# EAGLE design dop (EAGLE 9.4.2)
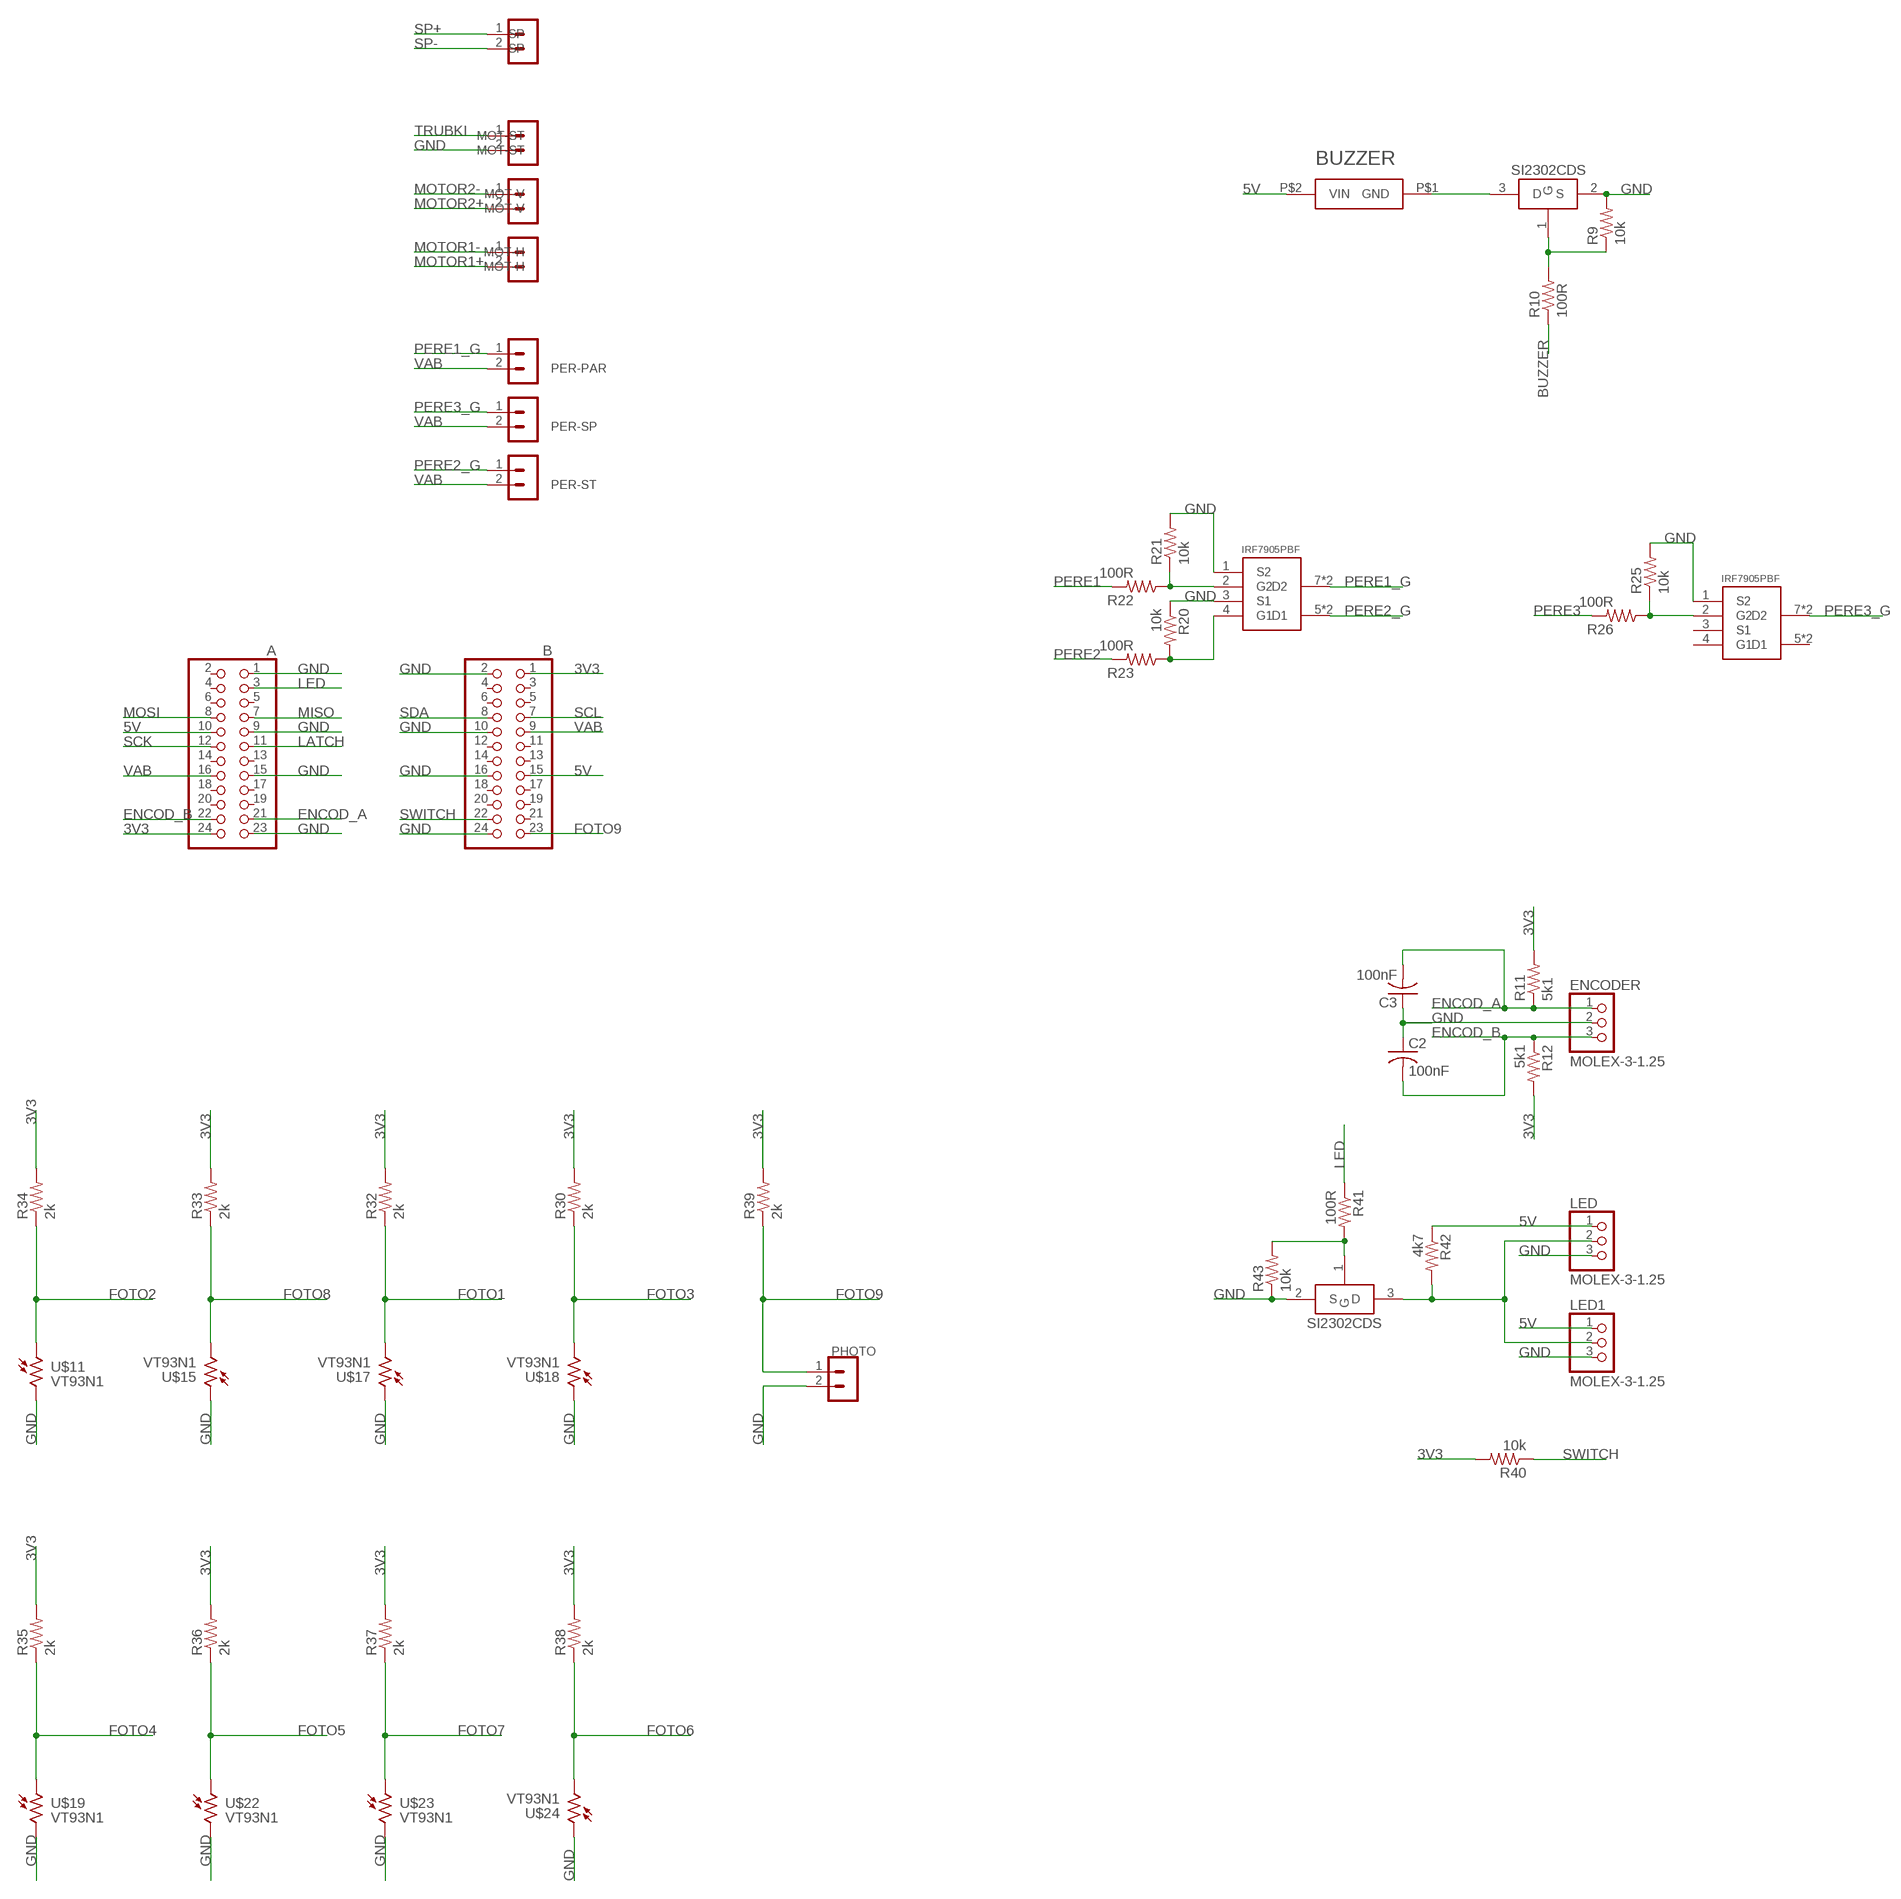
[diagram p0: schematic, sheet 1, part 1 of 2]
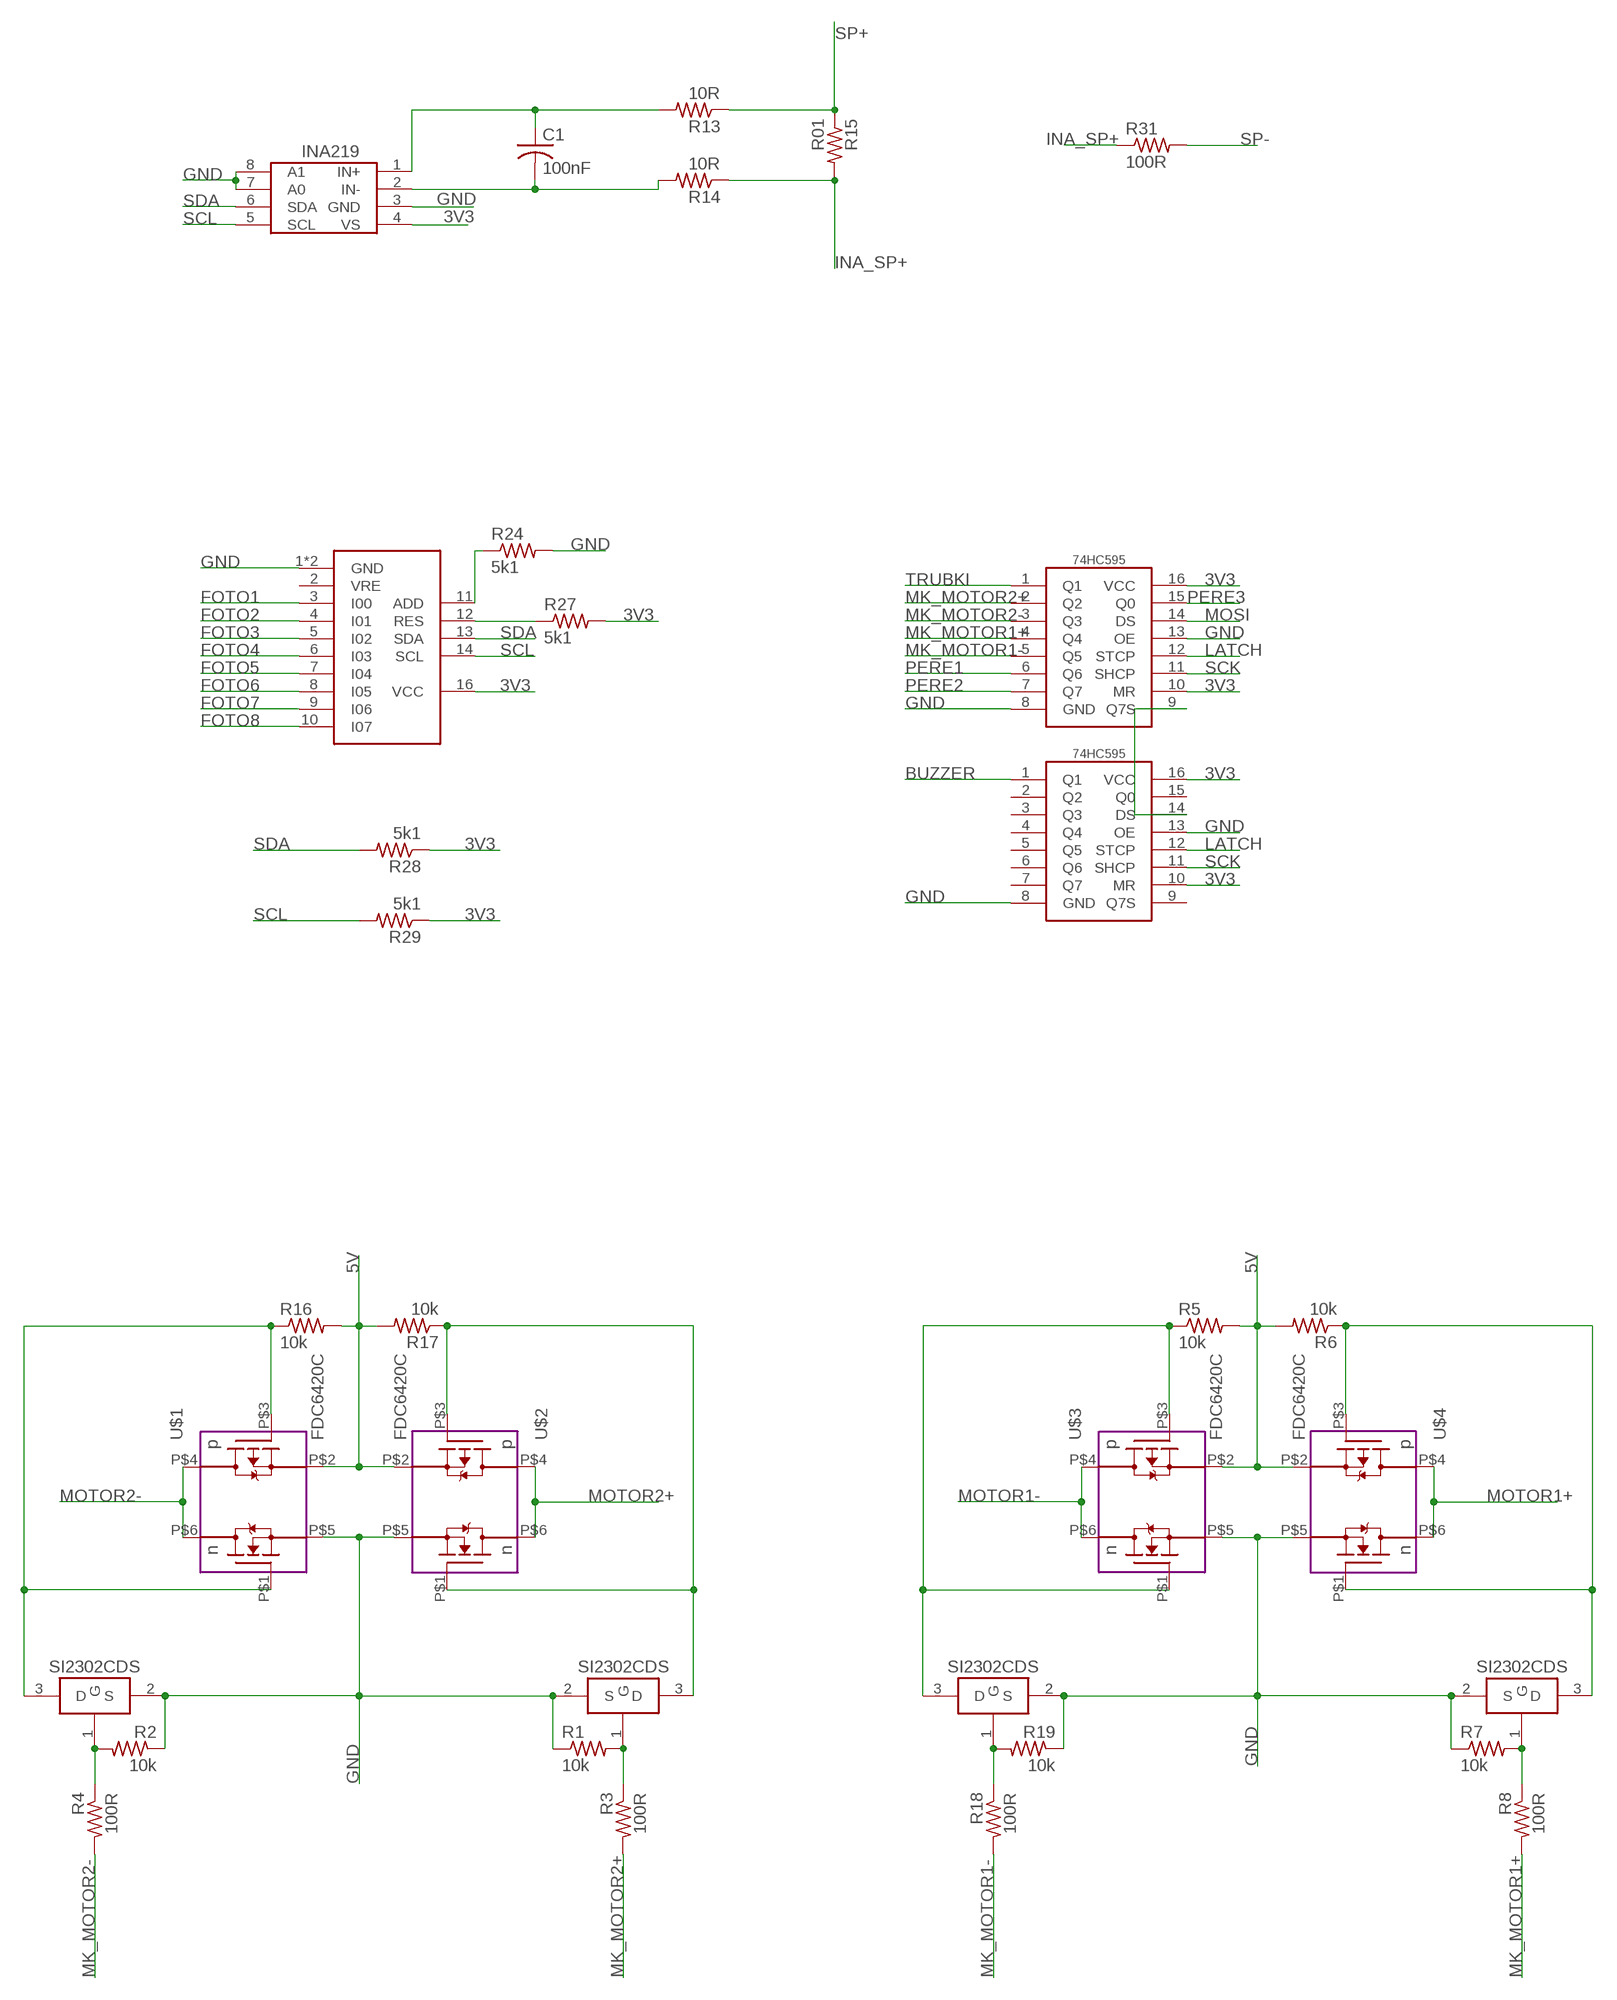
[diagram p1: schematic, sheet 1, part 2 of 2]

## Parts
74HC595  74HC595  [TSSOP16]
74HC595-  74HC595  [TSSOP16]
A  PINHD-2X12  [2X12]
AD5593  AD5593  [AD5593]
B  PINHD-2X12  [2X12]
BUZZER  BUZZERS8R6  [BUZZER-S8R12]
C1  100nF  C-USC0603  [C0603]
C2  100nF  C-USC0603  [C0603]
C3  100nF  C-USC0603  [C0603]
ENCODER  MOLEX-3-1.25  [53047-03]
INA  INA219AID  [SOT23-8]
IRF7905  IRF7905  [SO8]
IRF7905-  IRF7905  [SO8]
LED  MOLEX-3-1.25  [53047-03]
LED1  MOLEX-3-1.25  [53047-03]
MOT-H  MOLEX-2-1.25  [53047-02]
MOT-ST  MOLEX-2-1.25  [53047-02]
MOT-V  MOLEX-2-1.25  [53047-02]
PER-PAR  JST-2-2.5  [JST-2-2.5]
PER-SP  JST-2-2.5  [JST-2-2.5]
PER-ST  JST-2-2.5  [JST-2-2.5]
PHOTO  MOLEX-2-1.25  [53047-02]
R1  10k  R-US_R0603  [R0603]
R2  10k  R-US_R0603  [R0603]
R3  100R  R-US_R0603  [R0603]
R4  100R  R-US_R0603  [R0603]
R5  10k  R-US_R0603  [R0603]
R6  10k  R-US_R0603  [R0603]
R7  10k  R-US_R0603  [R0603]
R8  100R  R-US_R0603  [R0603]
R9  10k  R-US_R0603  [R0603]
R10  100R  R-US_R0603  [R0603]
R11  5k1  R-US_R0603  [R0603]
R12  5k1  R-US_R0603  [R0603]
R13  10R  R-US_R0603  [R0603]
R14  10R  R-US_R0603  [R0603]
R15  R01  R-US_R2512  [R2512]
R16  10k  R-US_R0603  [R0603]
R17  10k  R-US_R0603  [R0603]
R18  100R  R-US_R0603  [R0603]
R19  10k  R-US_R0603  [R0603]
R20  10k  R-US_R0603  [R0603]
R21  10k  R-US_R0603  [R0603]
R22  100R  R-US_R0603  [R0603]
R23  100R  R-US_R0603  [R0603]
R24  5k1  R-US_R0603  [R0603]
R25  10k  R-US_R0603  [R0603]
R26  100R  R-US_R0603  [R0603]
R27  5k1  R-US_R0603  [R0603]
R28  5k1  R-US_R0603  [R0603]
R29  5k1  R-US_R0603  [R0603]
R30  2k  R-US_R0603  [R0603]
R31  100R  R-US_0207/15  [0207/15]
R32  2k  R-US_R0603  [R0603]
R33  2k  R-US_R0603  [R0603]
R34  2k  R-US_R0603  [R0603]
R35  2k  R-US_R0603  [R0603]
R36  2k  R-US_R0603  [R0603]
R37  2k  R-US_R0603  [R0603]
R38  2k  R-US_R0603  [R0603]
R39  2k  R-US_R0603  [R0603]
R40  10k  R-US_R0603  [R0603]
R41  100R  R-US_R0603  [R0603]
R42  4k7  R-US_R0603  [R0603]
R43  10k  R-US_R0603  [R0603]
SI2302  SI2302CDS  [SOT23-3]
SI2302-  SI2302CDS  [SOT23-3]
SI2302-1  SI2302CDS  [SOT23-3]
SI2302-2  SI2302CDS  [SOT23-3]
SI2302-3  SI2302CDS  [SOT23-3]
SI2302-4  SI2302CDS  [SOT23-3]
SP  MOLEX-2-1.25  [53047-02]
U$1  FDC6420C  [TSOP-6]
U$2  FDC6420C  [TSOP-6]
U$3  FDC6420C  [TSOP-6]
U$4  FDC6420C  [TSOP-6]
U$11  VT93N1  [VT93N1]
U$15  VT93N1  [VT93N1]
U$17  VT93N1  [VT93N1]
U$18  VT93N1  [VT93N1]
U$19  VT93N1  [VT93N1]
U$22  VT93N1  [VT93N1]
U$23  VT93N1  [VT93N1]
U$24  VT93N1  [VT93N1]

## Nets
3V3: 74HC595-.10(MR) 74HC595-.16(VCC) 74HC595.10(MR) 74HC595.16(VCC) A.24 AD5593.16(VCC) B.1 INA.4(VS) R11.2 R12.2 R27.2 R28.1 R29.1 R30.2 R32.2 R33.2 R34.2 R35.2 R36.2 R37.2 R38.2 R39.2 R40.2
5V: A.10 B.15 BUZZER.P$2(VIN) LED1.1 LED.1 R5.2 R6.2 R16.2 R17.2 R42.1 U$1.P$2(PS) U$2.P$2(PS) U$3.P$2(PS) U$4.P$2(PS)
BUZZER: 74HC595-.1(Q1) R10.1
ENCOD_A: A.21 C3.2 ENCODER.1 R11.1
ENCOD_B: A.22 C2.2 ENCODER.3 R12.1
FOTO1: AD5593.3(I00) R32.1 U$17.P$2
FOTO2: AD5593.4(I01) R34.1 U$11.P$1
FOTO3: AD5593.5(I02) R30.1 U$18.P$2
FOTO4: AD5593.6(I03) R35.1 U$19.P$1
FOTO5: AD5593.7(I04) R36.1 U$22.P$1
FOTO6: AD5593.8(I05) R38.1 U$24.P$2
FOTO7: AD5593.9(I06) R37.1 U$23.P$1
FOTO8: AD5593.10(I07) R33.1 U$15.P$2
FOTO9: B.23 PHOTO.1 R39.1
GND: 74HC595-.8(GND) 74HC595-.13(OE) 74HC595.8(GND) 74HC595.13(OE) A.1 A.9 A.15 A.23 AD5593.1(GND) AD5593.15(GND) B.2 B.10 B.16 B.24 C2.1 C3.1 ENCODER.2 INA.3(GND) INA.7(A0) INA.8(A1) IRF7905-.1(S2) IRF7905.1(S2) IRF7905.3(S1) LED1.3 LED.3 MOT-ST.2 PHOTO.2 R1.1 R2.1 R7.1 R9.2 R19.1 R20.1 R21.2 R24.2 R25.2 R43.1 SI2302-1.2(S) SI2302-2.2(S) SI2302-3.2(S) SI2302-4.2(S) SI2302-.2(S) SI2302.2(S) U$1.P$5(NS) U$2.P$5(NS) U$3.P$5(NS) U$4.P$5(NS) U$11.P$2 U$15.P$1 U$17.P$1 U$18.P$1 U$19.P$2 U$22.P$2 U$23.P$2 U$24.P$1
INA_SP+: R14.1 R15.2 R31.1
LATCH: 74HC595-.12(STCP) 74HC595.12(STCP) A.11
LED: A.3 R41.1
MISO: A.7
MK_MOTOR1+: 74HC595.4(Q4) R8.2
MK_MOTOR1-: 74HC595.5(Q5) R18.2
MK_MOTOR2+: 74HC595.2(Q2) R3.2
MK_MOTOR2-: 74HC595.3(Q3) R4.2
MOSI: 74HC595.14(DS) A.8
MOTOR1+: MOT-H.2 U$4.P$4(PD) U$4.P$6(ND)
MOTOR1-: MOT-H.1 U$3.P$4(PD) U$3.P$6(ND)
MOTOR2+: MOT-V.2 U$2.P$4(PD) U$2.P$6(ND)
MOTOR2-: MOT-V.1 U$1.P$4(PD) U$1.P$6(ND)
N$1: R1.2 R3.1 SI2302-3.1(G)
N$3: R2.2 R4.1 SI2302-1.1(G)
N$5: R5.1 SI2302-2.3(D) U$3.P$1(NG) U$3.P$3(PG)
N$6: R7.2 R8.1 SI2302-4.1(G)
N$7: R18.1 R19.2 SI2302-2.1(G)
N$8: R6.1 SI2302-4.3(D) U$4.P$1(NG) U$4.P$3(PG)
N$10: IRF7905.4(G1) R20.2 R23.1
N$12: IRF7905.2(G2) R21.1 R22.1
N$13: BUZZER.P$1(GND) SI2302-.3(D)
N$14: R9.1 R10.2 SI2302-.1(G)
N$15: C1.1 INA.1(IN+) R13.2
N$16: C1.2 INA.2(IN-) R14.2
N$17: R41.2 R43.2 SI2302.1(G)
N$18: AD5593.12(RES) R27.1
N$19: R17.1 SI2302-3.3(D) U$2.P$1(NG) U$2.P$3(PG)
N$20: AD5593.11(ADD) R24.1
N$21: IRF7905-.2(G2) R25.1 R26.1
N$22: 74HC595-.14(DS) 74HC595.9(Q7S)
N$23: LED1.2 LED.2 R42.2 SI2302.3(D)
N$24: R16.1 SI2302-1.3(D) U$1.P$1(NG) U$1.P$3(PG)
PERE1: 74HC595.6(Q6) R22.2
PERE1_G: IRF7905.7(D2) IRF7905.8(D2) PER-PAR.1
PERE2: 74HC595.7(Q7) R23.2
PERE2_G: IRF7905.5(D1) IRF7905.6(D1) PER-ST.1
PERE3: 74HC595.15(Q0) R26.2
PERE3_G: IRF7905-.7(D2) IRF7905-.8(D2) PER-SP.1
SCK: 74HC595-.11(SHCP) 74HC595.11(SHCP) A.12
SCL: AD5593.14(SCL) B.7 INA.5(SCL) R29.2
SDA: AD5593.13(SDA) B.8 INA.6(SDA) R28.2
SP+: R13.1 R15.1 SP.1
SP-: R31.2 SP.2
SWITCH: B.22 R40.1
TRUBKI: 74HC595.1(Q1) MOT-ST.1
VAB: A.16 B.9 PER-PAR.2 PER-SP.2 PER-ST.2
Unconnected: 74HC595-.2(Q2) 74HC595-.3(Q3) 74HC595-.4(Q4) 74HC595-.5(Q5) 74HC595-.6(Q6) 74HC595-.7(Q7) 74HC595-.9(Q7S) 74HC595-.15(Q0) A.2 A.4 A.5 A.6 A.13 A.14 A.17 A.18 A.19 A.20 AD5593.2(VRE) B.3 B.4 B.5 B.6 B.11 B.12 B.13 B.14 B.17 B.18 B.19 B.20 B.21 IRF7905-.3(S1) IRF7905-.4(G1) IRF7905-.5(D1) IRF7905-.6(D1)

## Library data of the parts
74HC595 74HC595- = CanCubeSat:74HC595
A B = pinhead:PINHD-2X12: PIN HEADER
AD5593 = CanCubeSat:AD5593
BUZZER = CanCubeSat:BUZZER
C1-C3 = rcl:C-US: CAPACITOR, American symbol; SPICEPREFIX: C
ENCODER LED LED1 = CanCubeSat:MOLEX-3-1.25
INA = CanCubeSat:INA219AID
IRF7905 IRF7905- = CanCubeSat:IRF7905
MOT-H MOT-ST MOT-V PHOTO SP = CanCubeSat:MOLEX-2-1.25
PER-PAR PER-SP PER-ST = CanCubeSat:JST-2-2.5: JST PH series header 2.00mm pitch disconnectable crimp style connectors, vertical (side entry type), 2 pins
R1-R30 R32-R43 = rcl:R-US_: RESISTOR, American symbol; SPICEPREFIX: R
R31 = CanCubeSat:R-US_: RESISTOR, American symbol; SPICEPREFIX: R
SI2302 SI2302- SI2302-1-SI2302-4 = CanCubeSat:SI2302CDS
U$1-U$4 = KNPN-2023:FDC6420C
U$11 U$15 U$17-U$19 U$22-U$24 = KNPN-2023:VT93N1

## Board
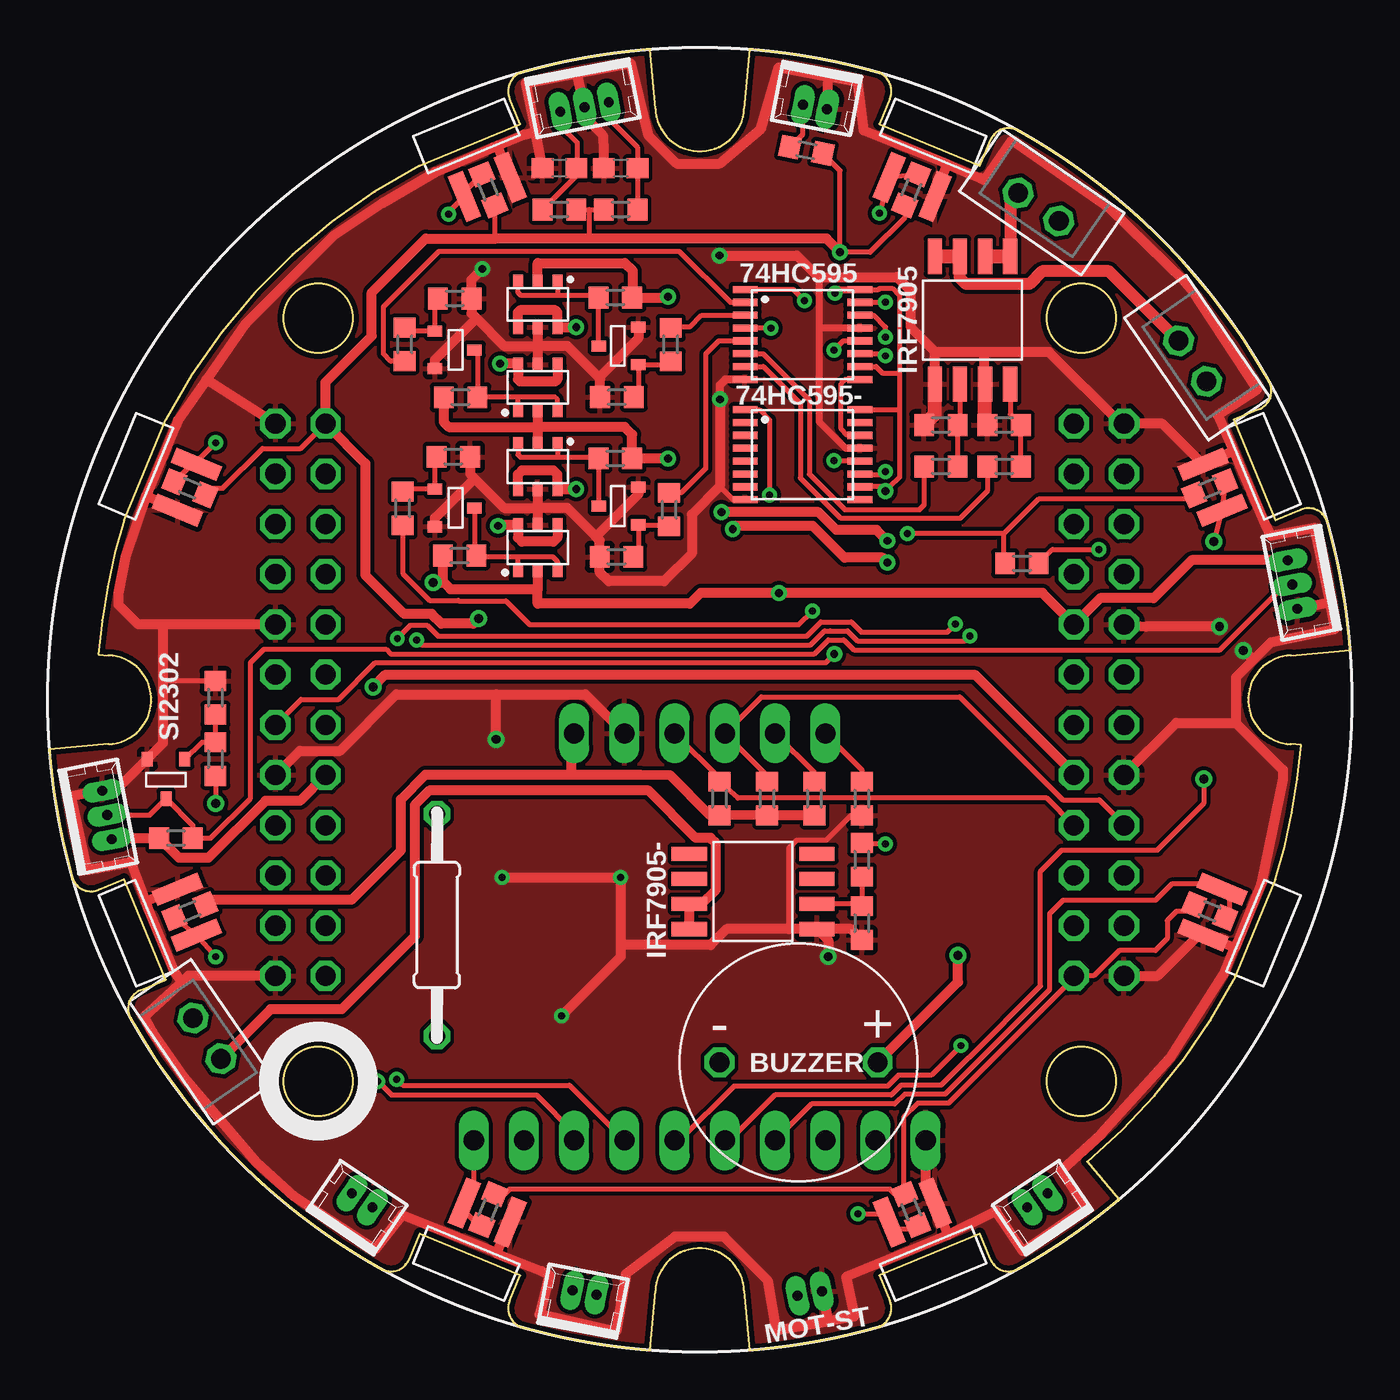
[diagram p2: board, top side]
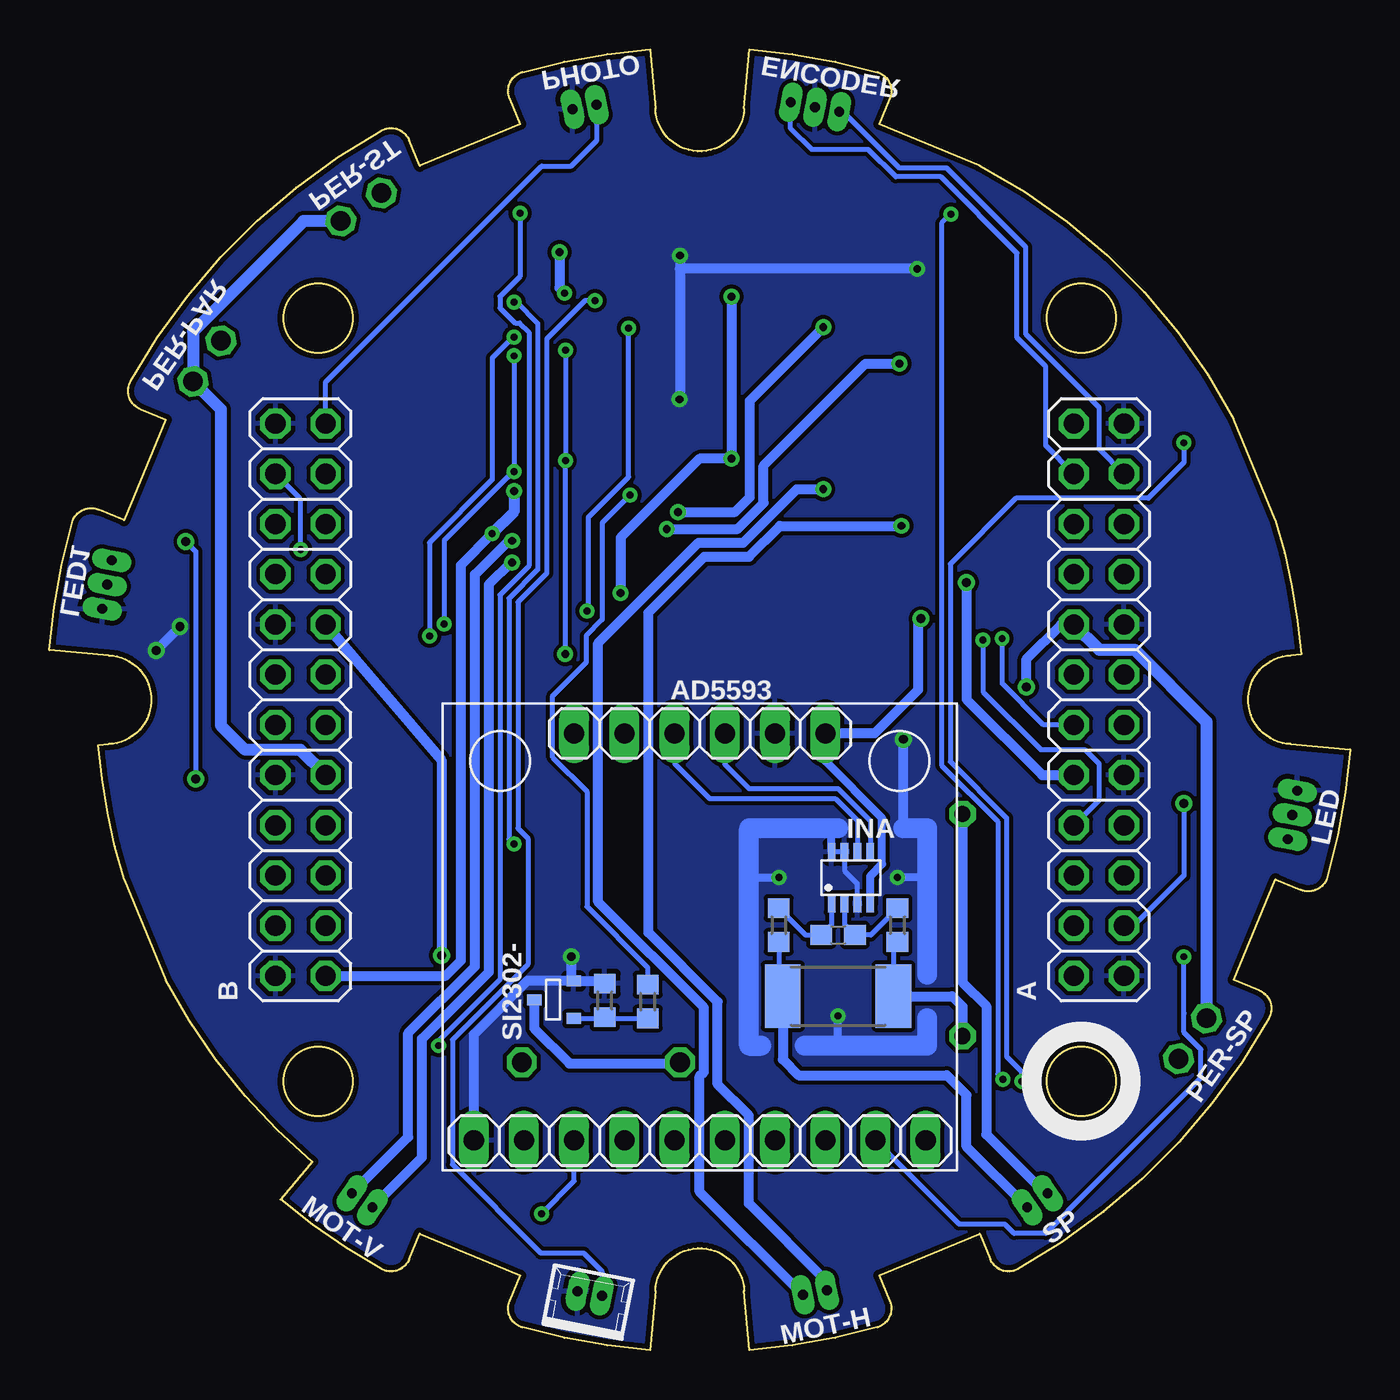
[diagram p3: board, bottom side, seen from below]

Size 65.81 x 65.81 mm. Coordinates in mm from the lower left corner, seen from the top.
Outline: 3.78,41.99 5.88,47.07 arc-35 18.74,59.92 23.82,62.03 23.28,63.32 arc-97 23.94,64.66 arc-11 30.39,65.81 30.66,62.82 arc176 35.15,62.82 35.41,65.81 arc-11 41.87,64.66 arc-97 42.53,63.32 41.99,62.03 47.07,59.92 47.61,61.21 arc-97 49.02,61.7 arc-32 61.7,49.02 arc-97 61.21,47.61 59.92,47.07 62.03,41.99 63.32,42.53 arc-97 64.66,41.87 arc-11 65.81,35.41 62.82,35.15 arc176 62.82,30.66 63.33,30.61 arc-13 62.03,23.82 59.92,18.74 arc-22 52.52,9.53 54.12,7.63 arc-11 49.02,4.11 arc-97 47.61,4.6 47.07,5.88 41.99,3.78 42.53,2.49 arc-97 41.87,1.15 arc-11 35.41,0 35.15,2.99 arc176 30.66,2.99 30.39,0 arc-11 23.94,1.15 arc-97 23.28,2.49 23.82,3.78 18.74,5.88 18.2,4.6 arc-97 16.79,4.11 arc-32 4.11,16.79 arc-97 4.6,18.2 5.88,18.74 3.78,23.82 2.49,23.28 arc-97 1.15,23.94 arc-11 0,30.39 2.99,30.66 arc176 2.99,35.15 2.48,35.2 arc-13 3.78,41.99
Outline: circle at 13.6,13.6 radius 1.75
Outline: circle at 52.2,13.6 radius 1.75
Outline: circle at 52.2,52.2 radius 1.75
Outline: circle at 13.6,52.2 radius 1.75
Copper layers (1*16): Top 0.035mm / dielectric 1.5mm / Bottom 0.035mm
Design rules "default *": minimum track width 0.2mm, minimum drill 0.35mm, track to track 0.2mm, track to pad 0.2mm, pad to pad 0.2mm, via to via 0.2mm, smd to smd 0.2mm, copper to edge 0.25mm, drill to drill 0.1mm, minimum pad ring 10mil, minimum via ring 8mil, stop-mask expansion 3mil, vias tented up to drill 0mil, thermal gap 10mil

### Footprints (pad centres in the part's own frame; a part is rotated, then mirrored left to right if it is on the bottom)
TSSOP16 = smd 1.26 x 0.36: 1 -2.9,2.275; 2 -2.9,1.625; 3 -2.9,0.975; 4 -2.9,0.325; 5 -2.9,-0.325; 6 -2.9,-0.975; 7 -2.9,-1.625; 8 -2.9,-2.275; 9 2.9,-2.275; 10 2.9,-1.625; 11 2.9,-0.975; 12 2.9,-0.325; 13 2.9,0.325; 14 2.9,0.975; 15 2.9,1.625; 16 2.9,2.275
2X12 = drill 1.016 octagon: 1 -13.97,-1.27; 2 -13.97,1.27; 3 -11.43,-1.27; 4 -11.43,1.27; 5 -8.89,-1.27; 6 -8.89,1.27; 7 -6.35,-1.27; 8 -6.35,1.27; 9 -3.81,-1.27; 10 -3.81,1.27; 11 -1.27,-1.27; 12 -1.27,1.27; 13 1.27,-1.27; 14 1.27,1.27; 15 3.81,-1.27; 16 3.81,1.27; 17 6.35,-1.27; 18 6.35,1.27; 19 8.89,-1.27; 20 8.89,1.27; 21 11.43,-1.27; 22 11.43,1.27; 23 13.97,-1.27; 24 13.97,1.27
AD5593 = drill 1.016 long: 1 -11.43,-10.3; 2 -8.89,-10.3; 3 -6.35,-10.3; 4 -3.81,-10.3; 5 -1.27,-10.3; 6 1.27,-10.3; 7 3.81,-10.3; 8 6.35,-10.3; 9 8.89,-10.3; 10 11.43,-10.3; 11 -6.35,10.3; 12 -3.81,10.3; 13 -1.27,10.3; 14 1.27,10.3; 15 3.81,10.3; 16 6.35,10.3
BUZZER-S8R12 = drill 1 octagon: P$1 -4,0; P$2 4,0
C0603 = smd 1.1 x 1: 1 -0.85,0; 2 0.85,0
53047-03 = drill 0.5 pad 0.698 long: 1 1.25,0.45; 2 0,0.45; 3 -1.25,0.45
SOT23-8 = smd 0.9 x 0.4: 1 -1.3,0.975; 2 -1.3,0.325; 3 -1.3,-0.325; 4 -1.3,-0.975; 5 1.3,-0.975; 6 1.3,-0.325; 7 1.3,0.325; 8 1.3,0.975
SO8 = smd 0.72 x 1.78: 1 -1.905,-3.23; 2 -0.635,-3.23; 3 0.635,-3.23; 4 1.905,-3.23; 5 1.905,3.23; 6 0.635,3.23; 7 -0.635,3.23; 8 -1.905,3.23
53047-02 = drill 0.5 pad 0.698 long: 1 0.625,0.45; 2 -0.625,0.45
JST-2-2.5 = drill 1 pad 1.5 octagon: 1 1.25,0; 2 -1.25,0
R0603 = smd 1 x 1.1: 1 -0.85,0; 2 0.85,0
R2512 = smd 1.8 x 3.2: 1 -2.8,0; 2 2.8,0
0207/15 = drill 0.813 octagon: 1 -5.62,0; 2 5.62,0
SOT23-3 = smd 0.56 x 0.73: 1 -0.95,-1; 2 0.95,-1; 3 0,1
TSOP-6 = smd 0.5 x 0.7: P$1 -1,-1.15; P$2 0,-1.15; P$3 1,-1.15; P$4 1,1.15; P$5 0,1.15; P$6 -1,1.15
VT93N1 = smd 0.8 x 2.5: P$1 -1.25,-1.8; P$2 1.25,-1.8

### Placement (x,y rotation side)
74HC595  38.1,51.38 0 top
74HC595-  38.1,45.3 0 top
A  12.7,32.9 90 bottom
AD5593  32.9,20.9 0 bottom
B  53.1,32.9 90 bottom
BUZZER  37.9,14.55 0 top
C1  25.9,21 0 bottom
C2  28.9,59.8 0 top
C3  25.8,59.8 0 top
ENCODER  26.99,63.33 191 top
INA  25.25,23.9 90 bottom
IRF7905  46.7,52.1 0 top
IRF7905-  35.6,23.2 90 top
LED  2.47,26.99 281 top
LED1  63.33,38.82 101 top
MOT-H  26.99,2.47 349 top
MOT-ST  38.55,2.42 349 bottom
MOT-V  50.24,7.2 34 top
PER-PAR  57.83,50.04 124.5 top
PER-SP  7.97,15.77 304.5 top
PER-ST  50.04,57.83 145.5 top
PHOTO  38.82,63.33 169 top
R1  20.5,53.2 180 top
R2  28.71,48.21 0 top
R3  17.97,50.88 270 top
R4  31.43,50.87 90 top
R5  28.63,45.11 0 top
R6  20.75,40.19 180 top
R7  20.43,45.19 180 top
R8  17.87,42.58 270 top
R9  37.71,17.69 90 bottom
R10  35.53,17.63 270 bottom
R11  25.8,57.7 0 top
R12  28.9,57.7 180 top
R13  28.9,21.5 90 bottom
R14  22.9,21.5 90 bottom
R15  25.9,17.9 0 bottom
R16  28.63,53.25 0 top
R17  20.8,48.2 180 top
R18  31.35,42.52 90 top
R19  28.69,40.13 0 top
R20  48.3,46.8 0 top
R21  45.1,46.8 180 top
R22  45.1,44.7 180 top
R23  48.3,44.7 180 top
R24  41.1,27.9 270 top
R25  41.1,21.6 270 top
R26  41.1,24.8 90 top
R27  38.7,27.9 270 top
R28  36.3,27.9 90 top
R29  33.9,27.9 90 top
R30  58.7,43.6 202.5 top
R31  19.6,21.5 90 top
R32  43.6,7.1 112.5 top
R33  22.2,7.1 67.5 top
R34  58.7,22.2 157.5 top
R35  43.6,58.7 247.5 top
R36  22.2,58.7 292.5 top
R37  7.1,22.2 22.5 top
R38  7.1,43.6 337.5 top
R39  38.3,60.7 349 top
R40  49.2,39.8 180 top
R41  8.4,29.9 90 top
R42  6.4,25.9 0 top
R43  8.4,33 270 top
SI2302  5.9,28.9 180 top
SI2302-  40.28,17.72 90 bottom
SI2302-1  28.8,50.8 90 top
SI2302-2  28.8,42.7 90 top
SI2302-3  20.5,50.6 270 top
SI2302-4  20.5,42.6 270 top
SP  15.57,7.2 326 top
U$1  24.7,52.9 180 top
U$2  24.7,48.7 0 top
U$3  24.7,44.7 180 top
U$4  24.7,40.6 0 top
U$11  60.51,21.47 247.5 top
U$15  21.47,5.29 157.5 top
U$17  44.34,5.29 202.5 top
U$18  60.51,44.34 292.5 top
U$19  44.34,60.51 337.5 top
U$22  21.47,60.51 22.5 top
U$23  5.29,21.47 112.5 top
U$24  5.29,44.34 67.5 top

### Tracks (layer width: path | path; a pad name or v marks a point on that pad's centre or on a via)
3V3  (via drill 0.35, 0.4, 0.45)
  Top 0.25: R34.2 57.59,22.2 57.03,22.2 56.56,21.74 56.56,20.82 55.96,20.22 54.12,20.22 52.84,18.93 B.1 51.93,18.93 47.9,14.9 45.5,12.5 43.93,12.5 43.25,11.82 43.25,7.92 R32.2 42.78,7.89 42.53,8.14 23.27,8.14 23.03,7.89 R33.2 | 43.02,47.58 43.02,44.16 42.54,43.68 42.4,43.68 | 74HC595-.16 43.02,47.58 | 42.4,43.68 74HC595-.10 | 43.02,49.44 43.02,53.35 42.64,53.72 42.01,53.72 41.95,53.66 74HC595.16 | 43.02,49.44 43.02,47.58 | 74HC595.10 41.82,49.76 42.14,49.44 43.02,49.44 | 42.4,43.68 42.4,43.57 v42.3,43.47 | R35.2 43.28,57.3 41.52,55.55 v40,55.55 40,59.68 R39.2 | R38.2 8.22,43.61 8.77,43.61 10.78,45.62 12.72,45.62 A.24 | 48.3,41.3 50.05,43.05 57.69,43.05 R30.2 | 48.3,41.3 v43.4,41.3 | R40.2 48.3,39.85 48.3,41.3 | R39.2 | R36.2 22.53,56.3 22.59,56.24 | R11.2 27.3,57.7 | 27.3,57.7 R12.2 | 27.3,57.7 27.3,56.24
  Top 0.35: v39.73,53.47 39.93,53.66 74HC595.16
  Top 0.5: R27.2 R28.1 33.99,27.06 R29.1 33.43,27.06 31.39,29.1 29.9,29.11 26.4,29.11 | v40,55.55 39.32,56.24 27.3,56.24 22.59,56.24 19.04,56.24 16.3,53.5 16.3,51.3 13.97,48.97 A.24 15.98,44.86 15.98,39.22 17.96,37.25 19.34,37.25 19.84,36.76 21.46,36.76 v21.7,37 | R37.2 8.15,22.79 15.29,22.79 17.79,25.29 17.79,27.87 19.03,29.11 26.4,29.11 | AD5593.16 26.4,31.2 26.4,29.11
  Bottom 0.4: INA.4 24.28,23.99 23.68,24.59 23.68,26.92 26.55,29.8 AD5593.16
  Bottom 0.5: v43.4,41.3 45,39.71 45,19.69 45.76,18.93 B.1 | v40,55.55 40,53.74 v39.73,53.47 | v21.7,37 21.85,36.85 21.85,33.4 24.05,31.2 AD5593.16
  Bottom 0.55: v42.3,43.47 42.3,42.4 v43.4,41.3
5V  (via drill 0.4, 0.45)
  Top 0.5: LED.1 3.21,25.9 R42.1 6.55,24.9 8.04,24.9 10.93,27.79 12.67,27.79 A.10 | LED1.1 57.79,39.96 55.88,38.04 53.16,38.04 B.15 50.24,38.3 v36.9,38.3 32.95,38.3 32.4,37.76 24.7,37.76 24.7,38.5 | BUZZER.P$2 45.97,18.62 v45.97,19.97 | U$2.P$2 24.7,46.7 | 24.7,46.7 U$3.P$2 | U$4.P$2 24.7,38.5 | U$1.P$2 24.7,55 29.1,55 29.5,54.6 29.5,53.27 R16.2 31.25,53.25 v31.3,53.3 | R17.2 19.95,46.95 20.2,46.7 24.7,46.7 | 24.7,46.7 29.1,46.7 29.48,46.32 R5.2 v31.29,45.11 v31.3,45.1 | R6.2 19.9,38.89 19.97,38.83 | 24.7,38.5 20.29,38.5 19.97,38.83 | v19.4,38.83 19.97,38.83
  Bottom 0.5: B.15 45.97,29.85 v45.97,19.97 | v19.4,38.83 19.4,32.92 15.57,29.09 A.10 | v31.3,53.3 v31.3,45.1 32.9,45.1 36.9,41.1 v36.9,38.3
BUZZER  (via drill 0.35)
  Top 0.25: v36.44,43.25 36.44,47.07 35.92,47.58 74HC595-.1
  Bottom 0.25: v36.44,43.25 37.84,41.85 37.84,36.95 38.64,36.14 38.64,34.8 40.34,33.1 40.34,29.99 38.62,28.27 38.62,22.44 35.53,19.36 R10.1
ENCOD_A
  Top 0.25: R11.1 26.65,59.4 C3.2 26.7,59.85 26.7,61.1 25.85,61.96 ENCODER.1
  Bottom 0.25: ENCODER.1 25.65,62.65 22.8,59.81 20.41,59.81 16.4,55.8 16.4,51.4 12.7,47.7 12.7,45.6 A.21
ENCOD_B
  Top 0.25: R12.1 C2.2 29.75,60.85 28.3,62.31 ENCODER.3
  Bottom 0.25: A.22 15.4,45.76 15.4,49.77 16.85,51.22 16.85,55.51 20.7,59.36 22.99,59.36 24.37,60.74 27.24,60.74 28.3,61.8 ENCODER.3
FOTO1  (via drill 0.35)
  Top 0.25: v40.9,6.9 42.07,6.9 U$17.P$2 42.86,6.12 43.73,6.12 R32.1
  Bottom 0.25: v40.9,6.9 39.25,8.55 AD5593.3
FOTO2
  Top 0.25: R34.1 59.69,22.08 59.69,23.07 59.45,23.31 U$11.P$1 59.32,23.31 59.05,23.58 56.78,23.58 55.96,22.76 51.28,22.76 50.6,22.07 50.6,18.23 45.31,12.95 43.28,12.95 42.78,12.45 38.56,12.45 AD5593.4
FOTO3  (via drill 0.45)
  Top 0.25: AD5593.5 34.42,10.6 36.71,12.9 42.59,12.9 43.09,13.4 45.12,13.4 46.51,14.79 46.52,14.79 50.15,18.42 50.15,24.22 51.22,25.3 56.06,25.3 58.4,27.65 v58.4,28.9 | R30.1 U$18.P$2 v58.9,40.9
  Bottom 0.25: v58.9,40.9 58.4,40.4 v58.4,28.9
FOTO4  (via drill 0.35)
  Top 0.25: AD5593.6 31.88,10.6 34.62,13.35 42.4,13.35 42.96,13.9 44.62,13.9 v46.12,15.4 | R35.1 U$19.P$1 v42,57.52
  Bottom 0.25: v42,57.52 42,54.31 43.01,53.31 43.01,52.73 42.25,51.96 42.01,51.96 41.55,51.5 41.55,39.67 43.01,38.21 43.01,18.75 46.12,15.63 v46.12,15.4
FOTO5  (via drill 0.35)
  Top 0.25: v17.58,13.7 17.88,13.4 26.31,13.4 29.09,10.62 AD5593.7 | R36.1 21,58.61 U$22.P$1 20.2,57.58 v20.2,57.48
  Bottom 0.25: v17.58,13.7 17.83,13.96 17.83,26.74 20.68,29.59 20.68,57.01 v20.2,57.48
FOTO6  (via drill 0.35)
  Top 0.25: AD5593.8 26.55,11 24.65,12.9 17.31,12.9 v16.62,13.59 | v8.4,45.9 7.44,44.94 | 7.44,44.94 U$24.P$2 | R38.1 7.32,44.94 7.44,44.94
  Bottom 0.25: v8.4,45.9 8.4,44.9 10.2,43.1 16.9,43.1 20.23,39.78 20.23,29.78 17.38,26.93 17.38,14.85 16.62,14.09 v16.62,13.59
FOTO7  (via drill 0.35)
  Top 0.25: R37.1 U$23.P$1 v8.4,19.9
  Bottom 0.25: AD5593.9 19.78,6.37 17.47,6.37 17,5.9 15.4,5.9 14.34,6.97 14.27,7.01 14.27,7.04 7.54,13.77 7.54,15.21 8.4,16.08 8.4,17.02 8.41,17.04 8.4,17.05 v8.4,19.9
FOTO8
  Top 0.25: R33.1 21.73,6.32 20.89,7.16 21,7.27 U$15.P$2 21,8 21.47,8.47 AD5593.10
FOTO9
  Top 0.25: R39.1 38.12,61.52 PHOTO.1
  Bottom 0.25: B.23 51.83,48.97 40.9,59.9 39.4,59.9 38.1,61.2 38.1,63 PHOTO.1
GND  (via drill 0.35, 0.4, 0.45)
  Top 0.25: 33.93,43.7 33.93,43.69 34.58,43.03 74HC595-.8 | R24.2 40.55,27.05 39.29,25.79 37.81,25.79 37.4,25.39 37.4,21.3 | R43.1 5.8,33.85 5.75,33.9
  Top 0.35: 74HC595-.13 40.28,45.63 38.95,46.96 38.95,51.71 | 74HC595.13 38.95,51.71 | 38.95,51.71 38.95,54.25 38.9,54.3
  Top 0.4: 74HC595.8 34.2,49.11 33.93,48.83 v33.93,48.1
  Top 0.5: 45.49,5.82 40.3,3.7 40.72,1.69 39.4,1.46 | 22.63,4.96 17.84,6.85 16.48,5.11 12.4,7.77 10.49,9.49 6.79,13.83 5.2,16.1 4.8,16.85 6.57,18.48 6.7,18.61 | MOT-ST.2 39.39,1.48 39.4,1.46 | 39.4,1.46 39.4,1.45 36.77,1 36.33,3.54 34.14,5.73 31.64,5.73 29.16,3.85 28.66,0.94 24.79,1.8 25.3,3.8 24.92,3.99 22.61,4.91 22.63,4.96 | 4.88,43.21 6.36,46.69 6.51,47.06 7.95,49.11 | 7.95,49.11 9.9,51.9 14.4,56.4 16.83,58.02 19.5,59.6 22.43,60.84 22.69,60.95 | 26.69,64.59 24.1,64.1 24.6,61.8 24.6,61.65 | 26.69,64.59 29.4,65.1 30.29,61.47 31.73,60.03 33.91,60.03 36,61.8 36.9,64.9 39.41,64.43 | 45.44,59.99 46.6,59.5 47.1,59.3 47.3,59.2 48.7,61.2 53.6,57.8 57.41,54.09 57.77,53.68 61.1,48.6 59.1,47.3 59.89,45.5 | 59.89,45.5 61.5,41.8 61.8,41.2 64,41.6 64.77,37.84 | 64.77,37.84 65.05,36.49 61.81,35.81 60.9,34.91 | 60.9,34.91 60.03,34.04 60.03,31.73 | 60.03,31.73 62.4,29.36 62.4,28.9 61.3,23.6 60,20.37 59.96,20.38 | 59.96,20.38 59.4,19 56.68,14.76 53.2,10.9 51.2,9.1 52.44,7.2 49.24,5 47.89,7.03 45.49,5.82 | 59.96,20.38 U$11.P$2 58.26,21.12 56.07,18.93 B.2 | LED1.3 64.77,37.84 | 26.69,64.59 ENCODER.2 27.08,62.39 28.01,61.46 C2.1 | U$24.P$1 4.88,43.21 | 59.89,45.5 U$18.P$1 56.31,46.87 B.24 54.37,46.9 54.17,46.9 50.57,50.5 47.3,50.5 | C3.1 24.6,61.65 | U$19.P$2 44.81,58.46 45.44,59.99 | R25.2 40.56,21.3 IRF7905-.1 | v33.9,55.38 37.82,55.38 38.9,54.3 42.88,54.3 43.59,53.58 43.59,51.73 44.8,50.52 44.8,50.5 | A.1 7.03,18.93 6.7,18.61 | 28.9,20.4 v28.9,23.9 v22.9,23.9 | 28.9,20.4 28.9,19.9 v25.9,16.9 | IRF7905-.1 37.4,21.3 34.26,21.3 33.45,20.49 28.99,20.49 28.9,20.4 | IRF7905-.1 39.4,20.73 v39.4,19.9
  Top 0.5: B.10 57.01,31.73 60.03,31.73 | v59.2,36.6 55.48,36.6 B.16 | A.9 12.66,30.32 14.7,30.32 17.55,33.18 22.6,33.18 | AD5593.15 27.12,33.18 22.6,33.18 | v22.6,30.9 22.6,33.18 | AD5593.1 44.33,8.58 U$17.P$1 45.47,5.84 45.49,5.82 | U$15.P$1 22.63,4.96 | 4.88,43.21 3.87,40.22 3.5,38.28 3.5,37.7 4.49,36.71 5.8,36.71 | 39.41,64.43 40.91,64.14 41.2,61.7 45.44,59.99 | PHOTO.2 39.41,64.43 | 4.86,22.69 4.1,24.7 1.9,24.3 1.08,28 LED.3 3.35,28.3 SI2302.2 5.75,30.7 5.75,33.9 5.75,36.66 5.8,36.71 | 4.86,22.69 5.03,22.23 6.31,19.15 6.7,18.61 | U$23.P$2 4.86,22.69 | v60.4,35.4 60.9,34.91 | 22.69,60.95 24,61.5 24.6,61.65 | A.23 7.95,49.11 | U$22.P$2 22.69,60.95 | U$1.P$5 24.7,50.8 | 24.7,50.8 U$2.P$5 | U$3.P$5 24.7,42.6 | 24.7,42.6 U$4.P$5 | A.15 5.8,36.71 | IRF7905.1 44.8,50.5 | 47.3,50.5 44.8,50.5 | IRF7905.3 47.3,48.91 47.3,50.5 | 21.6,52.2 21.35,52.45 R1.1 21.35,54.15 v21.9,54.7 | 21.6,52.2 23,50.8 24.7,50.8 | R2.1 27.86,49.14 27.8,49.2 | 24.7,50.8 26.2,50.8 27.8,49.2 | 27.65,41.15 27.84,40.96 R19.1 27.84,39.36 28.3,38.9 31.1,38.9 32.5,40.3 32.5,42.28 33.93,43.7 v33.93,48.1 | 27.65,41.15 26.2,42.6 24.7,42.6 | R7.1 21.28,44.32 21.5,44.1 | 21.5,44.1 23,42.6 24.7,42.6 | SI2302-3.2 19.5,50.1 21.6,52.2 | SI2302-4.2 19.5,42.1 21.5,44.1 | SI2302-2.2 29.8,43.3 27.65,41.15 | SI2302-1.2 29.8,51.2 27.8,49.2
  Top 0.7: R21.2 44.8,47.35 IRF7905.1 | R20.1 47.34,46.92 IRF7905.3
  Bottom 0.25: 39.31,18.7 SI2302-.2 | INA.3 24.93,23.59 25.58,24.24 INA.7 INA.8
  Bottom 0.4: INA.8 26.23,26.4 25.9,26.4 | 21.4,23.9 v22.9,23.9 | 30.4,23.9 v28.9,23.9 | 25.9,15.4 v25.9,16.9
  Bottom 0.5: SI2302-.2 37.84,18.67 R9.2 | v33.9,55.38 33.9,54.7 | 33.9,54.7 33.9,48.1 v33.93,48.1 | AD5593.1 44.33,15.97 41.6,18.7 39.31,18.7 39.4,18.79 v39.4,19.9 | v59.2,36.6 v60.4,35.4 | 22.6,26.4 v22.6,30.9 | v21.9,54.7 33.9,54.7
  Bottom 1: 25.9,26.4 30.4,26.4 30.4,23.9 30.4,15.4 29.8,15.4 | 21.4,16.8 21.4,15.4 25.9,15.4 27.6,15.4 | 22.6,26.4 21.4,26.4 21.4,23.9 21.4,19
  pour Top: -1.1,66.3 -1.1,-0.4 66.3,-0.4 66.3,66.3
  pour Bottom: -1.1,66.3 -1.1,-0.4 66.3,-0.4 66.3,66.3
INA_SP+
  Bottom 0.25: R14.1 23.1,20.45 R15.2
  Bottom 0.5: R15.2 20.12,17.9 19.6,17.38 R31.1
LATCH  (via drill 0.35, 0.4)
  Top 0.25: 74HC595-.12 39.73,44.98 v39.7,45 | 74HC595.12 40.16,51.06 v39.7,50.6 | v39.71,35.21 39.28,34.78 16.49,34.78 14.64,32.93 12.73,32.93 A.11
  Bottom 0.25: v39.7,50.6 v39.7,45 v39.7,35.21 v39.71,35.21
LED  (via drill 0.45)
  Top 0.25: R41.1 v8.4,27.66
  Bottom 0.25: v8.4,27.66 8.4,24 10.93,21.47 A.3
MK_MOTOR1+  (via drill 0.35)
  Top 0.25: R8.2 17.87,39.3 19.24,37.93 20.68,37.93 20.7,37.9 23.1,37.9 24.3,36.7 37.9,36.7 37.91,36.7 v38.61,37.4 | v36.5,51.7 74HC595.4
  Bottom 0.25: v36.5,51.7 36.5,44.18 38.54,42.14 38.54,37.47 v38.61,37.4
MK_MOTOR1-
  Top 0.25: 74HC595.5 33.86,51.06 33.2,50.4 33.2,44.6 31.97,43.37 R18.2
MK_MOTOR2+
  Top 0.25: 74HC595.2 34.45,53.01 31.86,55.6 19.71,55.6 16.9,52.79 16.9,50.4 17.27,50.03 R3.2
MK_MOTOR2-
  Top 0.25: 74HC595.3 33,52.36 32.4,51.76 31.43,51.76 R4.2
MOSI  (via drill 0.35)
  Top 0.25: 74HC595.14 41.71,52.36 42.3,51.76 v42.3,51.26 | v18.58,35.93 18.83,35.68 38.51,35.68 39.22,36.39 39.5,36.39 40.38,36.39 40.89,35.88 46.33,35.88 v46.58,36.13
  Bottom 0.25: v42.3,51.26 42.56,51.01 42.6,51.01 43.4,50.2 43.4,44.03 46.58,40.86 v46.58,36.13 | v18.58,35.93 18.58,33.31 15.65,30.38 13.42,30.38 12.69,29.64 12.69,27.84 A.8
MOTOR1+  (via drill 0.4)
  Top 0.5: U$4.P$4 25.7,41.1 25.5,40.9 23.9,40.9 23.7,41.1 U$4.P$6 22.75,41.75 v22.7,41.7
  Bottom 0.5: MOT-H.2 26.46,3.46 30.42,7.42 30.42,11.87 32,13.45 32,17.63 35.5,21.13 35.5,37.32 32.67,40.15 30.41,40.15 28.85,41.7 v22.71,41.7 v22.7,41.7
MOTOR1-  (via drill 0.4)
  Top 0.5: U$3.P$4 23.7,44.3 23.9,44.5 25.5,44.5 25.7,44.3 U$3.P$6 v26.65,43.55 v26.66,43.56
  Bottom 0.5: MOT-H.1 32.9,8.01 32.9,13.85 32.7,14.06 32.7,17.34 38.04,22.68 38.04,35.77 32.96,40.85 30.7,40.85 27.99,43.56 v26.66,43.56
MOTOR2+  (via drill 0.4)
  Top 0.5: v42.4,39.85 42.16,40.09 40.23,40.09 38.63,41.7 34.73,41.7 v34.57,41.55 | v22.8,49.9 23.7,49.9 U$2.P$6 23.7,49.1 23.8,49 25.6,49 25.7,49.1 U$2.P$4
  Bottom 0.5: MOT-V.2 46.95,9.74 46.95,15.75 43.58,19.12 43.58,38.73 42.46,39.85 v42.4,39.85 | v34.57,41.55 30.99,41.55 29.67,42.86 29.67,44.75 24.51,49.9 v22.8,49.9
MOTOR2-  (via drill 0.4)
  Top 0.5: v42.4,40.95 41.85,41.5 39.82,41.5 38.92,42.4 v34.01,42.4 | U$1.P$4 23.7,52.5 23.8,52.6 25.6,52.6 25.7,52.5 U$1.P$6 v26.66,51.76
  Bottom 0.5: MOT-V.1 47.65,10.78 47.65,16.04 44.28,19.41 44.28,39.25 42.59,40.95 v42.4,40.95 | v34.01,42.4 31.12,42.4 30.37,43.15 30.37,48.04 v26.66,51.76
N$1
  Top 0.25: R1.2 19.5,53.05 SI2302-3.1 18.15,51.55 R3.1
N$3
  Top 0.25: R4.1 31.26,49.85 SI2302-1.1 29.8,48.45 R2.2
N$5
  Top 0.25: U$3.P$3 23.7,45.3 23.83,45.18 25.7,45.18 | U$3.P$1 25.7,45.18 | 25.7,45.18 27.72,45.18 R5.1 27.8,45.09 SI2302-2.3
N$6
  Top 0.25: R7.2 19.46,45.19 19.5,45.15 SI2302-4.1 17.99,43.55 R8.1
N$7
  Top 0.25: R18.1 31.27,41.75 SI2302-2.1 29.8,40.39 R19.2
N$8
  Top 0.25: U$4.P$3 25.7,39.9 25.48,40.13 23.7,40.13 | SI2302-4.3 21.5,40.29 R6.1 21.67,40.13 23.7,40.13 | U$4.P$1 23.7,40.13
N$10
  Top 0.25: R23.1 R20.2 48.61,47.35 IRF7905.4
N$12
  Top 0.25: R22.1 R21.1 46.07,46.92 IRF7905.2
N$13
  Bottom 0.5: SI2302-.3 41.28,16.28 39.5,14.5 33.95,14.5 BUZZER.P$1
N$14
  Bottom 0.25: SI2302-.1 37.7,16.78 | 37.7,16.78 R10.2 | R9.1 37.7,16.78
N$15
  Bottom 0.25: R13.2 27.55,21 C1.1 26.23,21.53 INA.1
N$16
  Bottom 0.25: R14.2 24.25,21 C1.2 25.58,21.53 INA.2
N$17
  Top 0.25: SI2302.1 7.7,30.75 R41.2 R43.2
N$18
  Top 0.25: AD5593.12 38.7,29.21 R27.1
N$19
  Top 0.25: U$2.P$3 25.7,48.1 25.58,48.23 23.7,48.23 | SI2302-3.3 21.65,50.45 R17.1 21.68,48.23 23.7,48.23 | U$2.P$1 23.7,48.23
N$20
  Top 0.25: AD5593.11 40.48,29.98 41.1,29.35 R24.1
N$21
  Top 0.25: IRF7905-.2 40.99,22.57 R25.1 R26.1
N$22
  Top 0.25: 74HC595.9 40.26,49.11 40.05,48.89 40.05,46.61 40.38,46.28 74HC595-.14
N$23
  Top 0.25: LED.2 5.08,27.08 SI2302.3 7.25,26.55 R42.2 8.16,25.9 10.18,27.92 10.18,34.78 10.86,35.46 17.02,35.46 17.26,35.23 38.7,35.23 39.41,35.94 40.2,35.94 40.71,35.43 59.22,35.43 62.53,38.73 LED1.2
N$24
  Top 0.25: U$1.P$3 23.7,53.5 23.83,53.38 25.7,53.38 | SI2302-1.3 27.78,50.82 R16.1 27.66,53.38 25.7,53.38 | U$1.P$1 25.7,53.38
PERE1
  Top 0.25: R22.2 44.25,42.76 44.02,42.52 40.24,42.52 38.45,44.31 38.45,48.07 36.11,50.41 74HC595.6
PERE1_G
  Top 0.25: 44.9,55.33 IRF7905.8
  Top 0.6: IRF7905.7 46.07,54.25 46.37,53.94 49.58,53.94 50.22,54.58 53.61,54.58 PER-PAR.1
  Top 0.7: IRF7905.7 44.9,55.33
PERE2
  Top 0.25: 74HC595.7 36.13,49.76 38,47.89 38,44.13 40.05,42.07 46.07,42.07 47.45,43.45 R23.2
PERE2_G
  Top 0.6: PER-ST.1 48.61,58.14 IRF7905.5
  Top 0.7: IRF7905.5 IRF7905.6
PERE3  (via drill 0.35)
  Top 0.25: 74HC595.15 42.24,53.01 v42.3,53.02 | v42.3,25.6 41.15,25.6 R26.2
  Bottom 0.25: v42.3,53.02 42.17,53.02 41.1,51.94 41.1,39.48 42.56,38.03 42.56,25.86 v42.3,25.6
PERE3_G
  Top 0.5: IRF7905-.8 IRF7905-.7 32.99,22.57 33.71,23.29 33.71,25.66 33.45,25.92 32.7,25.92 30.31,28.3 19.21,28.3 18.49,27.58 18.49,20.93 14.79,17.24 11.18,17.24 PER-SP.1
SCK  (via drill 0.35)
  Top 0.25: v42.3,44.45 42.17,44.3 41.03,44.3 74HC595-.11 | 74HC595.11 42.2,50.41 v42.3,50.3 | v17.6,36 18.28,36.68 19.1,36.68 19.65,36.13 38.32,36.13 39.03,36.84 40.57,36.84 41.08,36.33 45.43,36.33 v45.83,36.73
  Bottom 0.25: v42.3,50.3 v42.3,44.45 42.56,44.19 42.61,44.19 45.83,40.97 v45.83,36.73 | v17.6,36 17.6,33.72 15.51,31.63 A.12
SCL
  Top 0.25: B.7 50.46,27.93 34.83,27.93 R29.2 33.9,28.93 AD5593.14
  Bottom 0.25: AD5593.14 31.63,29.63 30.4,28.4 25.9,28.4 24.28,26.78 INA.5
SDA
  Top 0.25: B.8 54.37,26.59 53.12,27.84 51.27,27.84 46.06,33.05 36.02,33.05 AD5593.13 36.3,29.07 R28.2
  Bottom 0.25: AD5593.13 34.17,29.67 32.4,27.9 26.04,27.9 24.93,26.79 INA.6
SP+
  Bottom 0.25: R15.1 28.9,18.1 R13.1
  Bottom 0.5: SP.1 19.4,10.29 19.4,12.9 20.4,13.9 27.9,13.9 28.7,14.7 R15.1
SP-
  Bottom 0.5: R31.2 19.6,18.6 18.4,17.4 18.4,10.9 15.43,7.93 SP.2
SWITCH  (via drill 0.35)
  Top 0.25: R40.1 50.75,40.5 v53.1,40.5
  Bottom 0.25: v53.1,40.5 53.1,43 53.15,43.11 B.22
TRUBKI  (via drill 0.35)
  Top 0.25: v38.2,53.1 37.64,53.66 74HC595.1
  Bottom 0.25: v38.2,53.1 38.7,53.1 40.65,51.16 40.65,39.3 42.11,37.84 42.11,26.4 41.6,25.9 41.6,19.52 45.42,15.7 45.42,9.39 40.93,4.9 38.77,4.9 37.85,3.99 MOT-ST.1
VAB  (via drill 0.45)
  Top 0.5: v16.37,33.56 16.97,34.15 46.85,34.15 51.83,29.17 B.9
  Bottom 0.5: v16.37,33.56 16.37,34.96 14.62,36.71 A.16
  Bottom 0.6: B.9 53.11,30.37 55.9,30.37 57.14,31.61 57.14,47.6 PER-PAR.2 58.54,51.53 52.95,57.13 PER-ST.2 | PER-SP.2 7.27,31.79 10.91,35.44 12.7,35.44 A.16

### Text on the board
bNames: ENCODER | PHOTO | PER-ST | PER-PAR | LED1
tValues: 100nF*2 | 5k1*2 | FDC*4 | SI*2 | SI*2